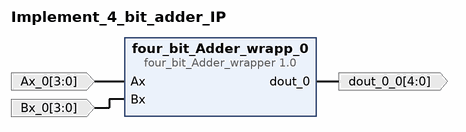
[diagram p0: block diagram of the top level]
# Vivado block design Implement_4_bit_adder_IP, xc7a100tcsg324-1, Vivado 2025.1
create_bd_design Implement_4_bit_adder_IP

create_bd_port -dir I -from 3 -to 0 Ax_0
create_bd_port -dir I -from 3 -to 0 Bx_0
create_bd_port -dir O -from 4 -to 0 dout_0_0

create_bd_cell -type ip -vlnv xilinx.com:user:four_bit_Adder_wrapper:1.0 four_bit_Adder_wrapp_0

# ---- connections ----

connect_bd_net -net Ax_0_1 [get_bd_ports Ax_0] [get_bd_pins four_bit_Adder_wrapp_0/Ax]
connect_bd_net -net Bx_0_1 [get_bd_ports Bx_0] [get_bd_pins four_bit_Adder_wrapp_0/Bx]
connect_bd_net [get_bd_pins four_bit_Adder_wrapp_0/dout_0] [get_bd_ports dout_0_0]

validate_bd_design
save_bd_design
